# Altium schematic sheet LED_CONV_SIG.SchDoc
size A; SheetNumber: 4; SheetTotal: 30
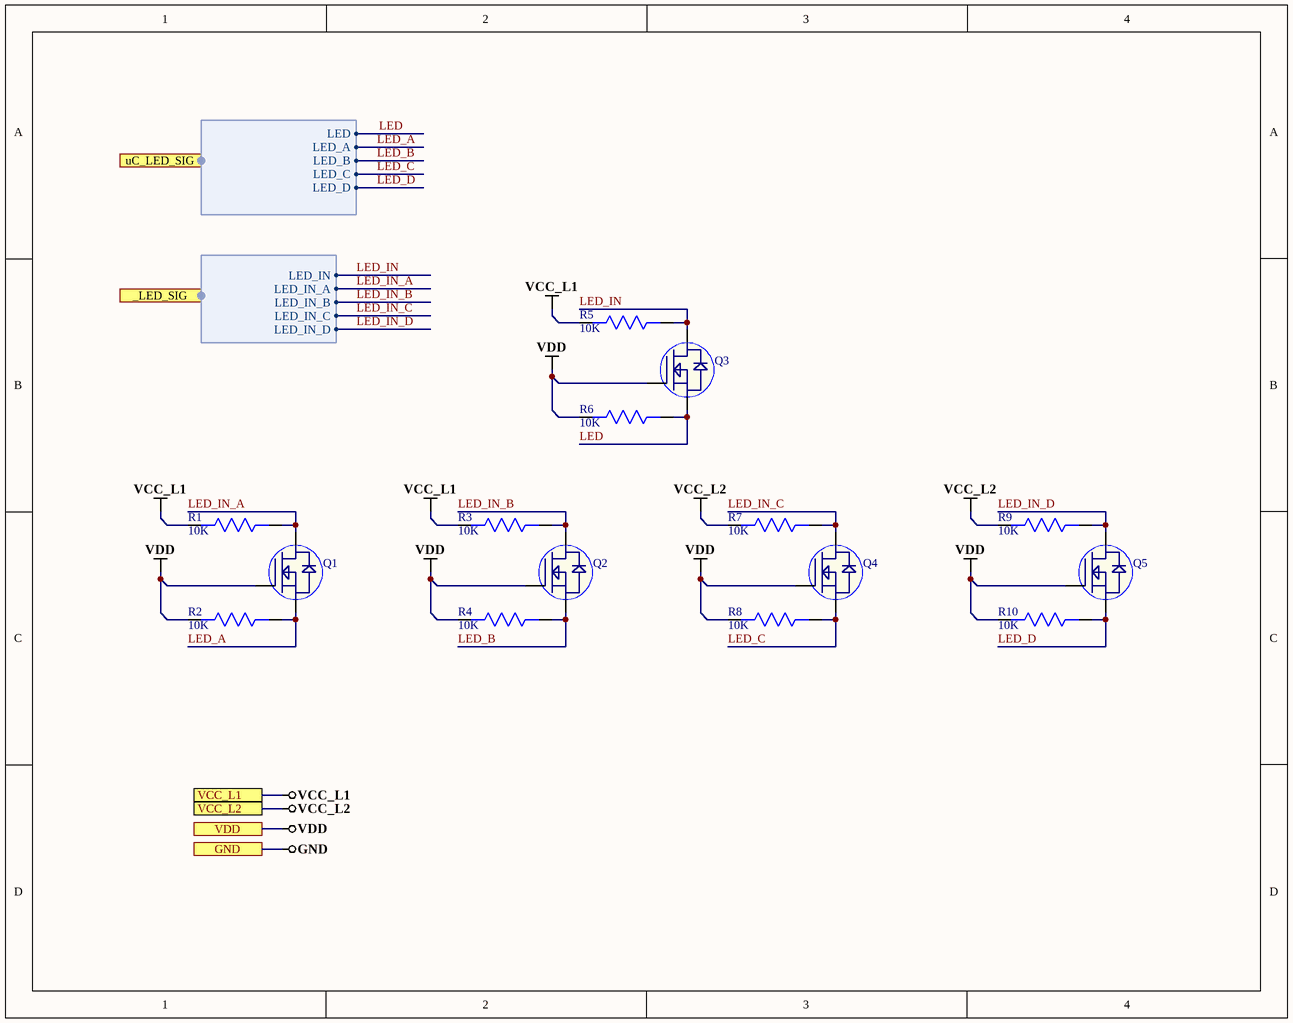
[diagram p0: LED_CONV_SIG.SchDoc]

## Parts
Q1  BSS138LT1G  [SOT23-3]  (value not drawn)
Q2  BSS138LT1G  [SOT23-3]  (value not drawn)
Q3  BSS138LT1G  [SOT23-3]  (value not drawn)
Q4  BSS138LT1G  [SOT23-3]  (value not drawn)
Q5  BSS138LT1G  [SOT23-3]  (value not drawn)
R1  10K  [Res-0201]
R2  10K  [Res-0201]
R3  10K  [Res-0201]
R4  10K  [Res-0201]
R5  10K  [Res-0201]
R6  10K  [Res-0201]
R7  10K  [Res-0201]
R8  10K  [Res-0201]
R9  10K  [Res-0201]
R10  10K  [Res-0201]

## Ports
_LED_SIG (harness Harness_8), GND, uC_LED_SIG (harness Harness_1), VCC_L1, VCC_L2, VDD

## Harnesses
Harness_1: LED_A, LED_B, LED_C, LED, LED_D
Harness_8: LED_IN, LED_IN_A, LED_IN_B, LED_IN_C, LED_IN_D

## Nets
GND: port GND
VCC_L1: R1.1 R3.1 R5.1 ; port VCC_L1
VCC_L2: R7.1 R9.1 ; port VCC_L2
VDD: Q1.1(G) Q2.1(G) Q3.1(G) Q4.1(G) Q5.1(G) R2.1 R4.1 R6.1 R8.1 R10.1 ; port VDD
LED: Q3.2(S) R6.2 ; port uC_LED_SIG.LED
LED_A: Q1.2(S) R2.2 ; port uC_LED_SIG.LED_A
LED_B: Q2.2(S) R4.2 ; port uC_LED_SIG.LED_B
LED_C: Q4.2(S) R8.2 ; port uC_LED_SIG.LED_C
LED_D: Q5.2(S) R10.2 ; port uC_LED_SIG.LED_D
LED_IN: Q3.3(D) R5.2 ; port _LED_SIG.LED_IN
LED_IN_A: Q1.3(D) R1.2 ; port _LED_SIG.LED_IN_A
LED_IN_B: Q2.3(D) R3.2 ; port _LED_SIG.LED_IN_B
LED_IN_C: Q4.3(D) R7.2 ; port _LED_SIG.LED_IN_C
LED_IN_D: Q5.3(D) R9.2 ; port _LED_SIG.LED_IN_D

## Library data of the parts
Q1-Q5 = BSS138LT1G: MOSFET N-CH 50V 200MA SOT-23; Manufacturer: ON Semiconductor; Gate to Source Voltage (Vgs): 20V; Nominal Vgs: 1.5V; Rds On Max: 3.5R; Input Capacitance: 50pF; Number of Elements: 1; Max Power Dissipation: 225mW; Turn-Off Delay Time: 20ns; Element Configuration: Single; ComponentLink1URL: https://datasheet.ciiva.com/22641/1596366-22641636.pdf; ComponentLink1Description: https://datasheet.ciiva.com/22641/1596366-22641636.pdf; ComponentLink2URL: https://datasheet.ciiva.com/1190/1596366-1190137.pdf; ComponentLink2Description: https://datasheet.ciiva.com/1190/1596366-1190137.pdf; ComponentLink3URL: https://datasheet.ciiva.com/15198/getdatasheetpartid-110266-15198908.pdf; ComponentLink3Description: https://datasheet.ciiva.com/15198/getdatasheetpartid-110266-15198908.pdf; ComponentLink4URL: https://datasheet.ciiva.com/8115/bss138lt1-d-8115295.pdf; ComponentLink4Description: https://datasheet.ciiva.com/8115/bss138lt1-d-8115295.pdf; ComponentLink5URL: https://datasheet.ciiva.com/8115/bss138lt1-d-8115358.pdf; ComponentLink5Description: https://datasheet.ciiva.com/8115/bss138lt1-d-8115358.pdf; ComponentLink6URL: https://datasheet.ciiva.com/1190/1596366-1190136.pdf; ComponentLink6Description: https://datasheet.ciiva.com/1190/1596366-1190136.pdf; ComponentLink7URL: https://datasheet.ciiva.com/936/bss138lt1-d-936802.pdf; ComponentLink7Description: https://datasheet.ciiva.com/936/bss138lt1-d-936802.pdf; ComponentLink8URL: https://datasheet.ciiva.com/936/bss138lt1-d-936801.pdf; ComponentLink8Description: https://datasheet.ciiva.com/936/bss138lt1-d-936801.pdf; ComponentLink9URL: https://datasheet.ciiva.com/14553/70099493-14553829.pdf; ComponentLink9Description: https://datasheet.ciiva.com/14553/70099493-14553829.pdf; ComponentLink10URL: https://datasheet.ciiva.com/936/bss138lt1-d-936803.pdf; ComponentLink10Description: https://datasheet.ciiva.com/936/bss138lt1-d-936803.pdf; Supplier 1: Digi-Key; Manufacturer Part Number: BSS138LT1G; Stock 1: 1283212; Pricing 1: 1=0.27, 10=0.222, 100=0.1177, 500=0.07746, 1000=0.05267 (USD); Case/Package: SOT-23-3; Number of Pins: 3; Contact Plating: Tin,Matte; Min Operating Temperature: -55°C; Max Operating Temperature: 150°C; Continuous Drain Current (ID): 200mA; Package Quantity: 1; Packaging: Tape and Reel; Drain to Source Breakdown Voltage: 50V; Power Dissipation: 225mW; Drain to Source Resistance: 3.5R; Threshold Voltage: 1.5V; Turn-On Delay Time: 20ns; Voltage Rating (DC): 50V; Current Rating: 200mA; On-State Resistance: 3.5R; Length: 3.04mm; Height: 1.01mm; Width: 1.4mm; Radiation Hardening: No; REACH SVHC: No SVHC; Lead Free: Lead Free; Halogen Free: Halogen Free; ComponentLink11URL: http://www.onsemi.com/pub/Collateral/BSS138LT1-D.PDF?src-supplier=Digi-Key; ComponentLink11Description: http://www.onsemi.com/pub/Collateral/BSS138LT1-D.PDF?src-supplier=Digi-Key; ComponentLink12URL: http://www.farnell.com/datasheets/1596366.pdf?src-supplier=Element14; ComponentLink12Description: http://www.farnell.com/datasheets/1596366.pdf?src-supplier=Element14; ComponentLink13URL: http://www.alliedelec.com/m/d/b3c6fd7d92596813fe75d33dcbaaae90.pdf?src-supplier=Allied+Electronics; ComponentLink13Description: http://www.alliedelec.com/m/d/b3c6fd7d92596813fe75d33dcbaaae90.pdf?src-supplier=Allied+Electronics; ComponentLink14URL: https://www.verical.com/server-webapp/html/getDatasheet?partID=110266&src-supplier=Verical; ComponentLink14Description: https://www.verical.com/server-webapp/html/getDatasheet?partID=110266&src-supplier=Verical; ComponentLink15URL: http://www.onsemi.com/pub_link/Collateral/BSS138LT1-D.PDF?src-supplier=Avnet; ComponentLink15Description: http://www.onsemi.com/pub_link/Collateral/BSS138LT1-D.PDF?src-supplier=Avnet; Supplier Part Number 1: BSS138LT1GOSDKR-ND
R1-R10 = RC0201FR-0710KL: GENERAL 0201 11% REEL (7INCH); Manufacturer: Yageo; Temperature Coefficient: 200ppm/°C; Resistance: 10kR; Tolerance: 1%; Max Power Dissipation: 50mW; Working Voltage: 25V; Supplier 1: Digi-Key; Manufacturer Part Number: RC0201FR-0710KL; RoHS: Yes; Category: Chip SMD Resistors; Stock 1: 6892350; Pricing 1: 1=0.10000, 10=0.03600, 100=0.01480, 1000=0.00665, 2500=0.00577, 5000=0.00477 (USD); Case/Package: 0201; Number of Pins: 2; Contact Plating: Tin,Matte; Weight: 6E-06oz; Case Code (Imperial): 0201; Case Code (Metric): 0603; Min Operating Temperature: -55°C; Max Operating Temperature: 125°C; Resistor Type: Thick Film; Features: Moisture Resistant; Termination: SMD/SMT; Number of Terminations: 2; Power Rating: 50mW; Voltage Rating: 25V; Packaging: Tape and Reel; Package Quantity: 1; Voltage Rating (DC): 25V; Length: 0.6mm; Width: 0.3mm; Height: 0.01inch; Depth: 0.3mm; Radiation Hardening: No; REACH SVHC: No SVHC; Military Standard: Not; Lead Free: Lead Free; ComponentLink1URL: https://datasheet.ciiva.com/2467/pyu-r-int-thick-7-2467109.pdf?src-supplier=Digi-Key; ComponentLink1Description: https://datasheet.ciiva.com/2467/pyu-r-int-thick-7-2467109.pdf?src-supplier=Digi-Key; ComponentLink2URL: https://datasheet.ciiva.com/2467/pyu-r-int-thick-7-2467110.pdf?src-supplier=Digi-Key; ComponentLink2Description: https://datasheet.ciiva.com/2467/pyu-r-int-thick-7-2467110.pdf?src-supplier=Digi-Key; ComponentLink3URL: https://datasheet.ciiva.com/2467/pyu-r-int-thick-7-2467111.pdf?src-supplier=Digi-Key; ComponentLink3Description: https://datasheet.ciiva.com/2467/pyu-r-int-thick-7-2467111.pdf?src-supplier=Digi-Key; ComponentLink4URL: https://datasheet.ciiva.com/7660/1421516-7660807.pdf?src-supplier=Element14; ComponentLink4Description: https://datasheet.ciiva.com/7660/1421516-7660807.pdf?src-supplier=Element14; ComponentLink5URL: https://datasheet.ciiva.com/8891/pyu-rc0201-51-rohs-l-8-8891384.pdf?src-supplier=Avnet; ComponentLink5Description: https://datasheet.ciiva.com/8891/pyu-rc0201-51-rohs-l-8-8891384.pdf?src-supplier=Avnet; ComponentLink6URL: https://datasheet.ciiva.com/28405/pyu-rc0201-51-rohs-l-8-28405609.pdf?src-supplier=Avnet+Europe; ComponentLink6Description: https://datasheet.ciiva.com/28405/pyu-rc0201-51-rohs-l-8-28405609.pdf?src-supplier=Avnet+Europe; ComponentLink7URL: https://datasheet.ciiva.com/26829/getdatasheetpartid-421074-26829851.pdf?src-supplier=Verical; ComponentLink7Description: https://datasheet.ciiva.com/26829/getdatasheetpartid-421074-26829851.pdf?src-supplier=Verical; ComponentLink8URL: https://datasheet.ciiva.com/46391/1421516-46391339.pdf?src-supplier=Element14; ComponentLink8Description: https://datasheet.ciiva.com/46391/1421516-46391339.pdf?src-supplier=Element14; ComponentLink9URL: https://datasheet.ciiva.com/16855/pyu-rc0201-51-rohs-l-8-16855789.pdf?src-supplier=Avnet+Europe; ComponentLink9Description: https://datasheet.ciiva.com/16855/pyu-rc0201-51-rohs-l-8-16855789.pdf?src-supplier=Avnet+Europe; Supplier Part Number 1: 311-10.0KMCT-ND